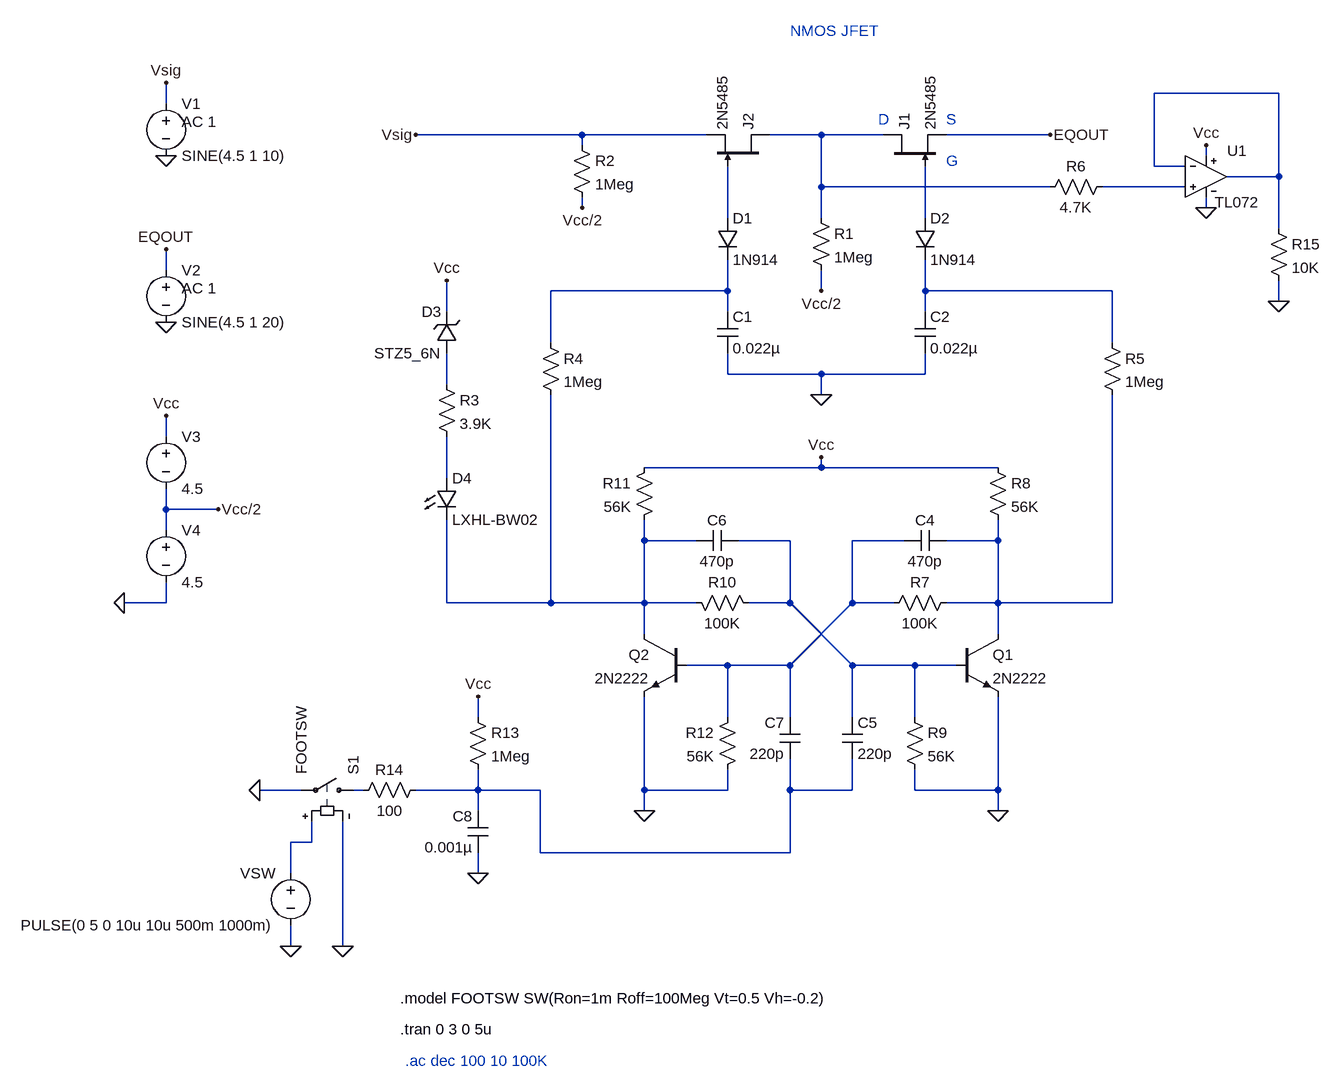
[diagram p0: schematic JFET_BJT_Foot_Switch.asc]
JFET_BJT_Foot_Switch.asc, the LTspice schematic file:
Version 4
SHEET 1 932 992
WIRE 864 -512 672 -512
WIRE -848 -496 -848 -528
WIRE -208 -448 -464 -448
WIRE -16 -448 -208 -448
WIRE 160 -448 80 -448
WIRE 256 -448 160 -448
WIRE 512 -448 352 -448
WIRE -208 -432 -208 -448
WIRE 752 -416 752 -432
WIRE 672 -400 672 -512
WIRE 720 -400 672 -400
WIRE 864 -384 864 -512
WIRE 864 -384 784 -384
WIRE 160 -368 160 -448
WIRE 512 -368 160 -368
WIRE 720 -368 592 -368
WIRE -208 -336 -208 -352
WIRE 752 -336 752 -352
WIRE 16 -320 16 -400
WIRE 160 -320 160 -368
WIRE 320 -320 320 -400
WIRE 864 -304 864 -384
WIRE -848 -240 -848 -272
WIRE 16 -208 16 -256
WIRE 16 -208 -256 -208
WIRE 160 -208 160 -240
WIRE 320 -208 320 -256
WIRE 608 -208 320 -208
WIRE 864 -192 864 -224
WIRE -416 -176 -416 -224
WIRE 16 -176 16 -208
WIRE 320 -176 320 -208
WIRE -256 -128 -256 -208
WIRE 608 -128 608 -208
WIRE 16 -80 16 -112
WIRE 160 -80 16 -80
WIRE 320 -80 320 -112
WIRE 320 -80 160 -80
WIRE -416 -64 -416 -112
WIRE 160 -48 160 -80
WIRE -848 16 -848 -16
WIRE 160 64 160 48
WIRE 160 64 -112 64
WIRE 432 64 160 64
WIRE -416 80 -416 16
WIRE -848 128 -848 96
WIRE -768 128 -848 128
WIRE -848 160 -848 128
WIRE -112 176 -112 144
WIRE -32 176 -112 176
WIRE 112 176 32 176
WIRE 288 176 208 176
WIRE 432 176 432 144
WIRE 432 176 352 176
WIRE -848 272 -848 240
WIRE -848 272 -912 272
WIRE -416 272 -416 144
WIRE -256 272 -256 -48
WIRE -256 272 -416 272
WIRE -112 272 -112 176
WIRE -112 272 -256 272
WIRE -32 272 -112 272
WIRE 112 272 112 176
WIRE 112 272 48 272
WIRE 208 272 208 176
WIRE 272 272 208 272
WIRE 432 272 432 176
WIRE 432 272 352 272
WIRE 608 272 608 -48
WIRE 608 272 432 272
WIRE -112 320 -112 272
WIRE 432 320 432 272
WIRE 16 368 -48 368
WIRE 112 368 208 272
WIRE 112 368 16 368
WIRE 208 368 112 272
WIRE 304 368 208 368
WIRE 368 368 304 368
WIRE -368 448 -368 416
WIRE 16 448 16 368
WIRE 112 448 112 368
WIRE 208 448 208 368
WIRE 304 448 304 368
WIRE -640 560 -704 560
WIRE -544 560 -560 560
WIRE -368 560 -368 528
WIRE -368 560 -464 560
WIRE -272 560 -368 560
WIRE -112 560 -112 416
WIRE 16 560 16 528
WIRE 16 560 -112 560
WIRE 112 560 112 512
WIRE 208 560 208 512
WIRE 208 560 112 560
WIRE 304 560 304 528
WIRE 432 560 432 416
WIRE 432 560 304 560
WIRE -368 592 -368 560
WIRE -112 592 -112 560
WIRE 432 592 432 560
WIRE -624 640 -624 608
WIRE -624 640 -656 640
WIRE -272 656 -272 560
WIRE 112 656 112 560
WIRE 112 656 -272 656
WIRE -656 688 -656 640
WIRE -368 688 -368 656
WIRE -656 800 -656 768
WIRE -576 800 -576 608
FLAG 160 -208 Vcc/2
FLAG 160 -48 0
FLAG -208 -336 Vcc/2
FLAG -464 -448 Vsig
FLAG -416 -224 Vcc
FLAG 512 -448 EQOUT
FLAG 432 592 0
FLAG -112 592 0
FLAG 160 48 Vcc
FLAG -368 416 Vcc
FLAG -368 688 0
FLAG -704 560 0
FLAG 752 -336 0
FLAG 752 -432 Vcc
FLAG 864 -192 0
FLAG -656 800 0
FLAG -576 800 0
FLAG -848 -160 0
FLAG -848 -416 0
FLAG -848 -528 Vsig
FLAG -848 -272 EQOUT
FLAG -912 272 0
FLAG -768 128 Vcc/2
FLAG -848 -16 Vcc
DATAFLAG 464 272 ""
DATAFLAG -240 272 ""
DATAFLAG 80 368 ""
DATAFLAG 288 368 ""
DATAFLAG 208 -368 ""
DATAFLAG -160 -448 ""
DATAFLAG 400 -448 ""
DATAFLAG -144 -208 ""
DATAFLAG 496 -208 ""
DATAFLAG -64 656 ""
SYMBOL njf 256 -400 R270
SYMATTR InstName J1
SYMATTR Value 2N5485
SYMBOL njf 80 -400 M270
SYMATTR InstName J2
SYMATTR Value 2N5485
SYMBOL res 144 -336 R0
SYMATTR InstName R1
SYMATTR Value 1Meg
SYMBOL diode 0 -320 R0
SYMATTR InstName D1
SYMATTR Value 1N914
SYMBOL diode 304 -320 R0
SYMATTR InstName D2
SYMATTR Value 1N914
SYMBOL cap 0 -176 R0
SYMATTR InstName C1
SYMATTR Value 0.022µ
SYMATTR SpiceLine V=16 Irms=0 Rser=0.0511 Lser=447p mfg="Würth Elektronik" pn="885012208029 WCAP-CSGP 1206" type="X7R"
SYMBOL cap 304 -176 R0
SYMATTR InstName C2
SYMATTR Value 0.022µ
SYMATTR SpiceLine V=16 Irms=0 Rser=0.0511 Lser=447p mfg="Würth Elektronik" pn="885012208029 WCAP-CSGP 1206" type="X7R"
SYMBOL res -224 -448 R0
SYMATTR InstName R2
SYMATTR Value 1Meg
SYMBOL zener -400 -112 R180
WINDOW 0 24 64 Left 2
WINDOW 3 24 0 Left 2
SYMATTR InstName D3
SYMATTR Value STZ5_6N
SYMBOL res -432 -80 R0
SYMATTR InstName R3
SYMATTR Value 3.9K
SYMBOL LED -432 80 R0
SYMATTR InstName D4
SYMATTR Value LXHL-BW02
SYMBOL res -272 -144 R0
SYMATTR InstName R4
SYMATTR Value 1Meg
SYMBOL res 592 -144 R0
SYMATTR InstName R5
SYMATTR Value 1Meg
SYMBOL res 608 -384 R90
WINDOW 0 0 56 VBottom 2
WINDOW 3 32 56 VTop 2
SYMATTR InstName R6
SYMATTR Value 4.7K
SYMBOL npn 368 320 R0
SYMATTR InstName Q1
SYMATTR Value 2N2222
SYMBOL res 368 256 R90
WINDOW 0 0 56 VBottom 2
WINDOW 3 32 56 VTop 2
SYMATTR InstName R7
SYMATTR Value 100K
SYMBOL cap 352 160 R90
WINDOW 0 0 32 VBottom 2
WINDOW 3 32 32 VTop 2
SYMATTR InstName C4
SYMATTR Value 470p
SYMATTR SpiceLine V=16 Irms=0 Rser=0.34 Lser=421p mfg="Würth Elektronik" pn="885012208021 WCAP-CSGP 1206" type="X7R"
SYMBOL res 416 48 R0
SYMATTR InstName R8
SYMATTR Value 56K
SYMBOL res 288 432 R0
SYMATTR InstName R9
SYMATTR Value 56K
SYMBOL cap 192 448 R0
SYMATTR InstName C5
SYMATTR Value 220p
SYMATTR SpiceLine V=16 Irms=0 Rser=0.5734 Lser=186p mfg="Würth Elektronik" pn="885012205021 WCAP-CSGP 0402" type="X7R"
SYMBOL npn -48 320 M0
SYMATTR InstName Q2
SYMATTR Value 2N2222
SYMBOL res -48 256 M90
WINDOW 0 0 56 VBottom 2
WINDOW 3 32 56 VTop 2
SYMATTR InstName R10
SYMATTR Value 100K
SYMBOL cap -32 160 M90
WINDOW 0 0 32 VBottom 2
WINDOW 3 32 32 VTop 2
SYMATTR InstName C6
SYMATTR Value 470p
SYMATTR SpiceLine V=16 Irms=0 Rser=0.34 Lser=421p mfg="Würth Elektronik" pn="885012208021 WCAP-CSGP 1206" type="X7R"
SYMBOL res -96 48 M0
SYMATTR InstName R11
SYMATTR Value 56K
SYMBOL res 32 432 M0
SYMATTR InstName R12
SYMATTR Value 56K
SYMBOL cap 128 448 M0
SYMATTR InstName C7
SYMATTR Value 220p
SYMATTR SpiceLine V=16 Irms=0 Rser=0.5734 Lser=186p mfg="Würth Elektronik" pn="885012205021 WCAP-CSGP 0402" type="X7R"
SYMBOL res -384 432 R0
SYMATTR InstName R13
SYMATTR Value 1Meg
SYMBOL cap -352 592 M0
SYMATTR InstName C8
SYMATTR Value 0.001µ
SYMATTR SpiceLine V=16 Irms=0 Rser=0.5734 Lser=186p
SYMBOL res -448 544 R90
WINDOW 0 0 56 VBottom 2
WINDOW 3 32 56 VTop 2
SYMATTR InstName R14
SYMATTR Value 100
SYMBOL sw -544 560 M270
SYMATTR InstName S1
SYMATTR Value FOOTSW
SYMBOL voltage -656 672 M0
WINDOW 123 0 0 Left 0
WINDOW 39 0 0 Left 0
SYMATTR InstName VSW
SYMATTR Value PULSE(0 5 0 10u 10u 500m 1000m)
SYMBOL TL072 752 -384 R0
SYMATTR InstName U1
SYMBOL res 848 -320 R0
SYMATTR InstName R15
SYMATTR Value 10K
SYMBOL voltage -848 -512 R0
WINDOW 123 24 44 Left 2
WINDOW 39 0 0 Left 0
SYMATTR InstName V1
SYMATTR Value SINE(4.5 1 10)
SYMATTR Value2 AC 1
SYMBOL voltage -848 -256 R0
WINDOW 123 24 44 Left 2
WINDOW 39 0 0 Left 0
SYMATTR InstName V2
SYMATTR Value SINE(4.5 1 20)
SYMATTR Value2 AC 1
SYMBOL voltage -848 0 R0
SYMATTR InstName V3
SYMATTR Value 4.5
SYMBOL voltage -848 144 R0
SYMATTR InstName V4
SYMATTR Value 4.5
TEXT 112 -608 Left 2 ;NMOS JFET
TEXT 248 -472 Left 2 ;D
TEXT 352 -408 Left 2 ;G
TEXT 352 -472 Left 2 ;S
TEXT -488 880 Left 2 !.model FOOTSW SW(Ron=1m Roff=100Meg Vt=0.5 Vh=-0.2)
TEXT -488 928 Left 2 !.tran 0 3 0 5u
TEXT -480 976 Left 2 ;.ac dec 100 10 100K

The netlist it stands for:
* JFET_BJT_Foot_Switch.asc
J1 N002 N005 EQOUT 2N5485
J2 N002 N004 Vsig 2N5485
R1 N002 Vcc/2 1Meg
D1 N004 N006 1N914
D2 N005 N007 1N914
C1 N006 0 0.022µ V=16 Irms=0 Rser=0.0511 Lser=447p mfg="Würth Elektronik" pn="885012208029 WCAP-CSGP 1206" type="X7R"
C2 N007 0 0.022µ V=16 Irms=0 Rser=0.0511 Lser=447p mfg="Würth Elektronik" pn="885012208029 WCAP-CSGP 1206" type="X7R"
R2 Vsig Vcc/2 1Meg
D3 N008 Vcc STZ5_6N
R3 N008 N009 3.9K
D4 N009 N010 LXHL-BW02
R4 N006 N010 1Meg
R5 N007 N013 1Meg
R6 N003 N002 4.7K
Q1 N013 N011 0 0 2N2222
R7 N013 N012 100K
C4 N013 N012 470p V=16 Irms=0 Rser=0.34 Lser=421p mfg="Würth Elektronik" pn="885012208021 WCAP-CSGP 1206" type="X7R"
R8 Vcc N013 56K
R9 N011 0 56K
C5 N011 N015 220p V=16 Irms=0 Rser=0.5734 Lser=186p mfg="Würth Elektronik" pn="885012205021 WCAP-CSGP 0402" type="X7R"
Q2 N010 N012 0 0 2N2222
R10 N010 N011 100K
C6 N010 N011 470p V=16 Irms=0 Rser=0.34 Lser=421p mfg="Würth Elektronik" pn="885012208021 WCAP-CSGP 1206" type="X7R"
R11 Vcc N010 56K
R12 N012 0 56K
C7 N012 N015 220p V=16 Irms=0 Rser=0.5734 Lser=186p mfg="Würth Elektronik" pn="885012205021 WCAP-CSGP 0402" type="X7R"
R13 Vcc N015 1Meg
C8 N015 0 0.001µ V=16 Irms=0 Rser=0.5734 Lser=186p
R14 N015 N014 100
S1 N014 0 N016 0 FOOTSW
VSW N016 0 PULSE(0 5 0 10u 10u 500m 1000m)
XU1 N003 N001 Vcc 0 N001 TL072  ; pins 1 2 3 4 5
R15 N001 0 10K
V1 Vsig 0 SINE(4.5 1 10) AC 1
V2 EQOUT 0 SINE(4.5 1 20) AC 1
V3 Vcc Vcc/2 4.5
V4 Vcc/2 0 4.5
.model D D
.lib standard.dio
.model NPN NPN
.model PNP PNP
.lib standard.bjt
.model NJF NJF
.model PJF PJF
.lib standard.jft
* NMOS JFET
* D
* G
* S
.model FOOTSW SW(Ron=1m Roff=100Meg Vt=0.5 Vh=-0.2)
.tran 0 3 0 5u
* .ac dec 100 10 100K
.lib D:\git-repos\LTSpice-Projects\TL072\TL072.lib
.backanno
.end